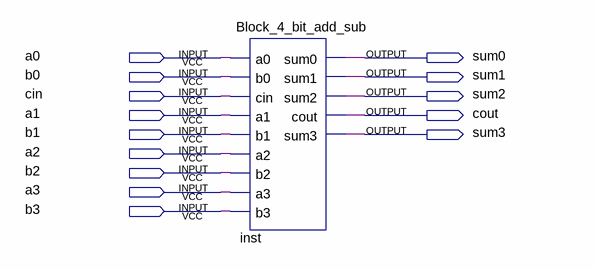
[diagram p0: schematic sheet]
// Quartus schematic Block_4_bit_add_sub_symbol.bdf as structural Verilog: 1 symbols, 14 pins
module Block_4_bit_add_sub_symbol (
  input  a0,
  input  b0,
  input  cin,
  input  a1,
  input  b1,
  input  a2,
  input  b2,
  input  a3,
  input  b3,
  output sum0,
  output sum1,
  output sum2,
  output cout,
  output sum3
);

  Block_4_bit_add_sub inst (
    .a0(a0), .b0(b0), .cin(cin), .a1(a1), .b1(b1), .a2(a2), .b2(b2), .a3(a3), .b3(b3), .sum0(sum0),
    .sum1(sum1), .sum2(sum2), .cout(cout), .sum3(sum3));
endmodule
